# Altium schematic sheet SWD_Touch_USB.SchDoc: SWD_Touch_USB.SchDoc
size A3; Project: STM32L073Z-EVAL; Date: Not used; ApprovedBy: Not used; CheckedBy: Not used; Author: Not used; CompanyName: STMicroelectronics; DrawnBy: Not used; Engineer: Not used; Organization: Not used; Address1: Not used; Address2: Not used; Address3: Not used; Address4: Not used; DocumentNumber: 11; Revision: Not used; SheetNumber: 12; SheetTotal: 13; CurrentTime: Not used; CurrentDate: Not used; Time: Not used; DocumentFullPathAndName: Not used; DocumentName: Not used; ModifiedDate: Not used; ImagePath: Not used; ProjectName: Not used; Application_BuildNumber: Not used
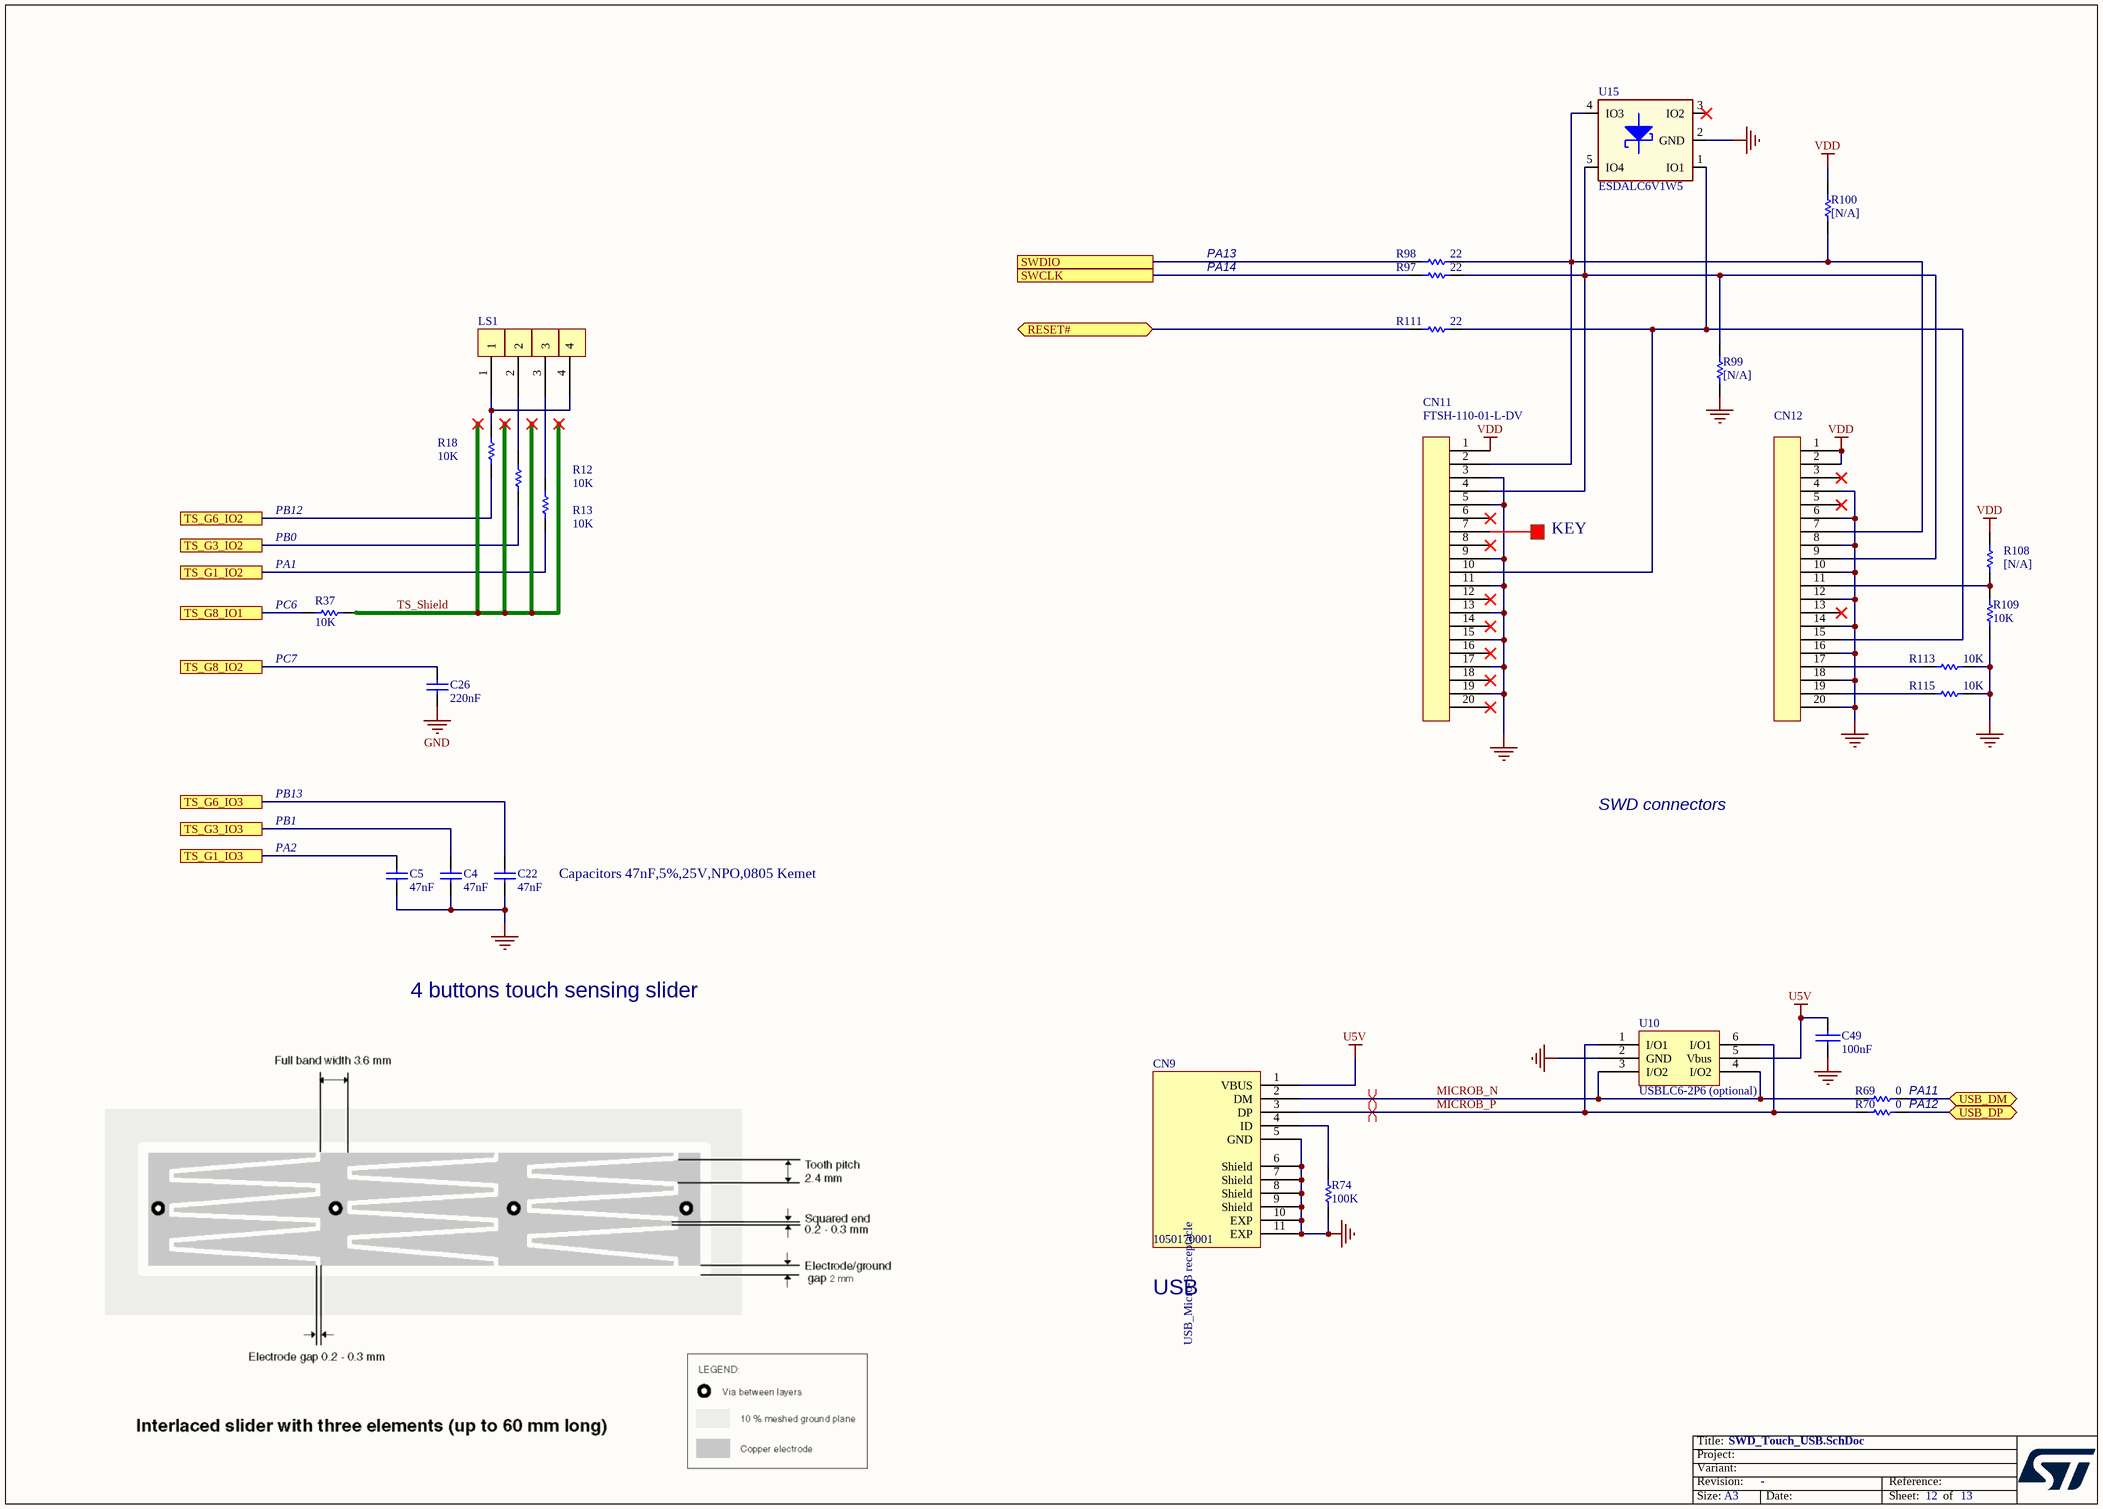
[diagram p0: SWD_Touch_USB.SchDoc]

## Parts
C4  47nF  [0805C]
C5  47nF  [0805C]
C22  47nF  [0805C]
C26  220nF  [0603C]
C49  100nF  [0402C]
CN9  1050170001  [MICRO_USB_B_105017]
CN11  FTSH-110-01-L-DV  [FTSH-110-01-L-DV]
CN12  JTAG  [IDC20S]  (value not drawn)
LS1  LS4  [LINEAR_SENSOR3_ELECTRODES]  (value not drawn)
R12  10K  [0603R]
R13  10K  [0603R]
R18  10K  [0603R]
R37  10K  [0603R]
R69  0  [0603R]
R70  0  [0603R]
R74  100K  [0603R]
R97  22  [0402R]
R98  22  [0402R]
R99  [N/A]  [0603R]
R100  [N/A]  [0603R]
R108  [N/A]  [0603R]
R109  10K  [0402R]
R111  22  [0402R]
R113  10K  [0402R]
R115  10K  [0402R]
U10  USBLC6-2P6 (optional)  [SOT-563]
U15  ESDALC6V1W5  [SOT-353]

## Ports
RESET# (bidir), SWCLK, SWDIO, TS_G1_IO2, TS_G1_IO3, TS_G3_IO2, TS_G3_IO3, TS_G6_IO2, TS_G6_IO3, TS_G8_IO1, TS_G8_IO2, USB_DM (bidir), USB_DP (bidir)

## Nets
GND: C4.1 C5.1 C22.1 C26.1 C49.2 CN9.5(GND) CN9.6(Shield) CN9.7(Shield) CN9.8(Shield) CN9.9(Shield) CN9.10(EXP) CN9.11(EXP) CN11.3 CN11.5 CN11.9 CN11.11 CN11.13 CN11.15 CN11.17 CN11.19 CN12.4 CN12.6 CN12.8 CN12.10 CN12.12 CN12.14 CN12.16 CN12.18 CN12.20 R74.1 R99.1 R109.1 R113.1 R115.1 U10.2(GND) U15.2(GND)
U5V: C49.1 CN9.1(VBUS) U10.5(Vbus)
VDD: CN11.1 CN12.1 CN12.2 R100.2 R108.2
MICROB_N: CN9.2(DM) R69.2 U10.3(I/O2) U10.4(I/O2)
MICROB_P: CN9.3(DP) R70.2 U10.1(I/O1) U10.6(I/O1)
RESET#: R111.2 ; port RESET#
SWCLK: R97.2 ; port SWCLK
SWDIO: R98.2 ; port SWDIO
TS_G1_IO2: R13.1 ; port TS_G1_IO2
TS_G1_IO3: C5.2 ; port TS_G1_IO3
TS_G3_IO2: R12.1 ; port TS_G3_IO2
TS_G3_IO3: C4.2 ; port TS_G3_IO3
TS_G6_IO2: R18.1 ; port TS_G6_IO2
TS_G6_IO3: C22.2 ; port TS_G6_IO3
TS_G8_IO1: R37.2 ; port TS_G8_IO1
TS_G8_IO2: C26.2 ; port TS_G8_IO2
TS_Shield: R37.1
USB_DM: R69.1 ; port USB_DM
USB_DP: R70.1 ; port USB_DP
NetCN9_4: CN9.4(ID) R74.2
NetCN11_2: CN11.2 CN12.7 R98.1 R100.1 U15.4(IO3)
NetCN11_4: CN11.4 CN12.9 R97.1 R99.2 U15.5(IO4)
NetCN11_10: CN11.10 CN12.15 R111.1 U15.1(IO1)
NetCN12_11: CN12.11 R108.1 R109.2
NetCN12_17: CN12.17 R113.2
NetCN12_19: CN12.19 R115.2
NetLS1_1: LS1.1 LS1.4 R18.2
NetLS1_2: LS1.2 R12.2
NetLS1_3: LS1.3 R13.2

Not connected (* = marked no-connect by the designer): CN11 6* 7 8* 12* 14* 16* 18* 20*; CN12 3* 5* 13*; U15 3(IO2)*

## Layout directives
differential pair: MICROB_N, MICROB_P

## Notes on the sheet
- PA13
- PA14
- PB12
- PB0
- (near R37) PA1
- KEY
- (near R37) PC6
- (near R37) PC7
- PB13
- PB1
- PA2
- SWD connectors
- Capacitors 47nF,5%,25V,NPO,0805 Kemet
- 4 buttons touch sensing slider
- PA12
- PA11
- USB
- Title:
- Project:
- Size:
- Revision:
- Variant:
- A3
- -
- Date:
- Reference:
- Sheet:
- of
- (in symbol 1050170001) USB_Micro-B receptacle

## Library data of the parts
C4 C5 C22 = Cap_47nF_NPO_5%: Capacitor 47nF,5%,25V,NPO,0805 Kemet; Order: C0805C473J3GACTU; Ordered by: Subcon; Revision: July-2002: Re-released for DXP Platform.; Value: 47nF; Manuf_1: Kemet; Manuf_Part_1: C0805C473J3GACTU; ECCN_US/EU: n/a
C26 = Cap: Capacitor; Value: 10nF; Ordered by: Subcon; Published: 8-Jun-2000; Revision: July-2002: Re-released for DXP Platform.; Publisher: Altium Limited; ECCN_US/EU: n/a
C49 = CAP: Capacitor; Ordered by: Subcon; ECCN_US/EU: n/a
CN9 = 1050170001: Manuf_1: MOLEX; Silkscreen: USB; Ordered by: Subcon; ECCN_US/EU: n/a; Manuf_Part_1: 1050170001
CN11 = 20PIN1: Manuf_1: towneS; Manuf_Part_1: P127B-2*10MGF-079-1E7; Ordered by: Subcon; Comments: Trace connector; Assembly: with pin7 removed; Silkscreen: Trace; Samtec components: FTSH-110-01-L-DV; ECCN_US/EU: n/a
CN12 = 20PIN1: Manuf_1: lwconn; Manuf_Part_1: 302520S01B0; Ordered by: Subcon; Comments: JTAG connector; Silkscreen: JTAG; ECCN_US/EU: n/a
LS1 = LS4: Ordered by: Subcon; ECCN_US/EU: n/a
R12 R13 R18 R37 = res1: Resistor; Value: 1K; Ordered by: Subcon; Published: 8-Jun-2000; Revision: July-2002: Re-released for DXP Platform.; Publisher: Altium Limited; ECCN_US/EU: n/a
R69 R70 R74 R97 R98 R109 R111 R113 R115 = Res1: Resistor; Value: 1K; Ordered by: Subcon; Published: 8-Jun-2000; Revision: July-2002: Re-released for DXP Platform.; Publisher: Altium Limited; ECCN_US/EU: n/a
R99 R100 R108 = Res1: Resistor; Value: 1K; Ordered by: Subcon; Fitted: NO; Published: 8-Jun-2000; Revision: July-2002: Re-released for DXP Platform.; Publisher: Altium Limited; ECCN_US/EU: n/a
U10 = USBLC6-2: Ordered by: ST; ECCN_US/EU: EAR99/NEC; Ref St: 9151057; Manuf_1: ST; Manuf_Part_1: USBLC6-2P6
U15 = ESDALC6V1W5: Dual Transil array for ESD protection; Manuf_1: ST; Ref St: 9151112; ECCN_US/EU: EAR99/NEC; Manuf_Part_1: ESDALC6V1W5; Distrib: ST; Provided: ST; Order: ESDALC6V1W5; Ordered by: ST